# Altium schematic sheet [04] Serial Console.SchDoc: USB-to-Serial converter
size A4; Organization: Blinkinlabs, LLC; DocumentNumber: 4; SheetNumber: 4; SheetTotal: 7
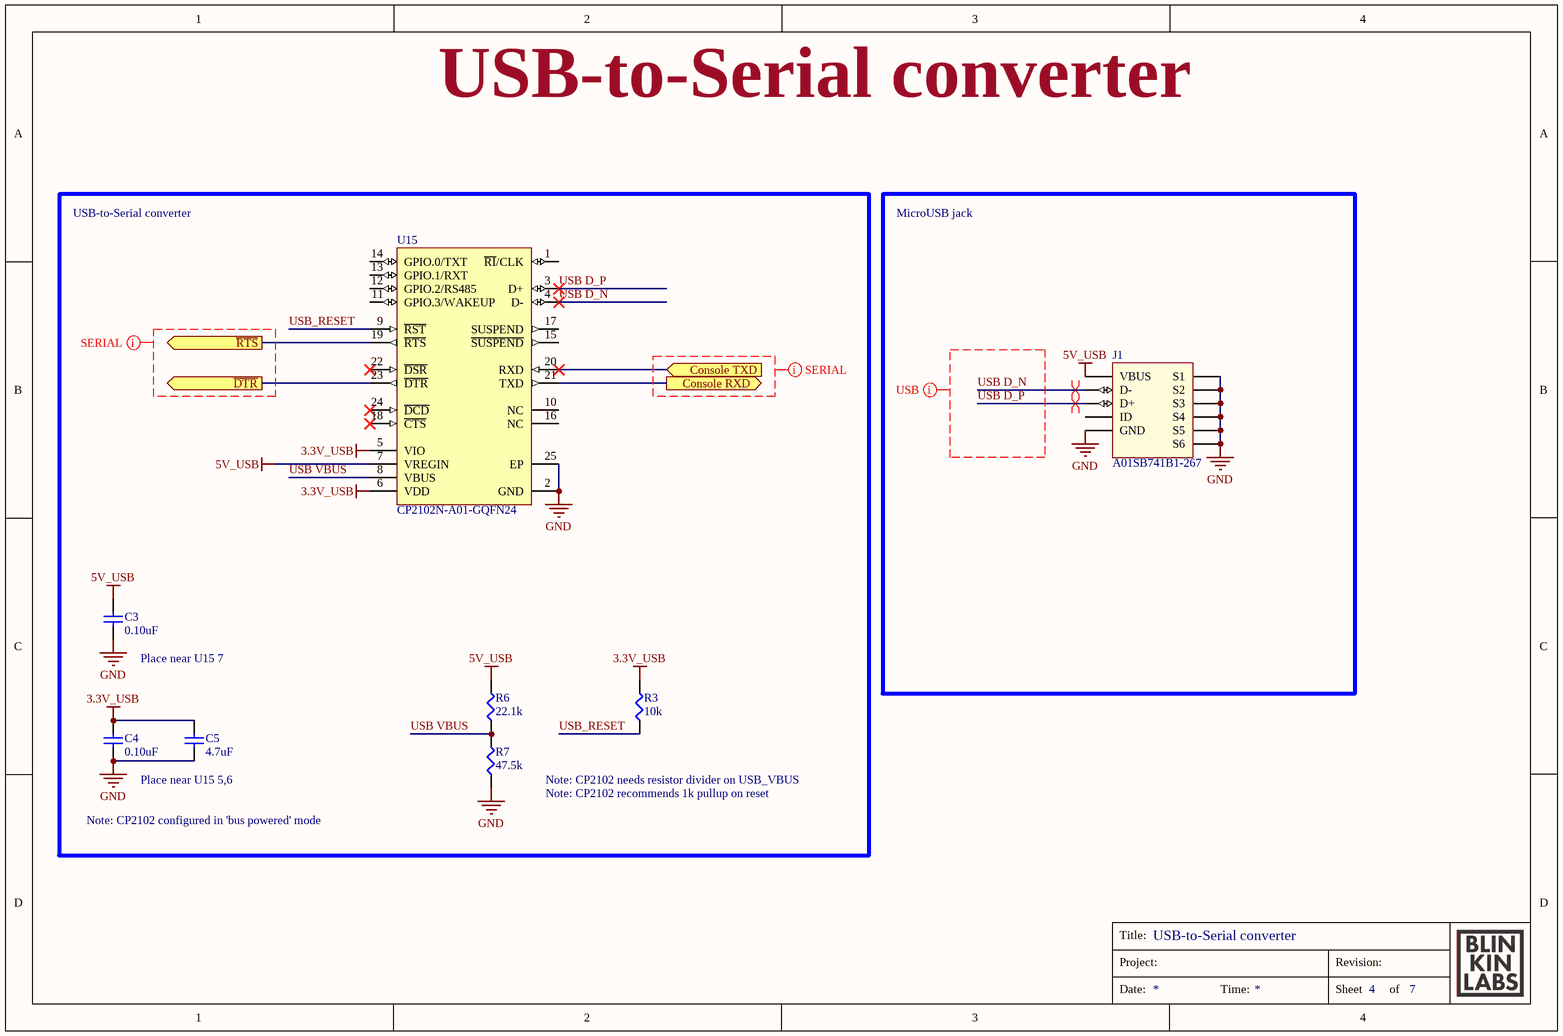
[diagram p0: [04] Serial Console.SchDoc]

## Parts
C3  0.10uF  [CAPC1005X06L]
C4  0.10uF  [CAPC1005X06L]
C5  4.7uF  [CAPC1608X09L]
J1  A01SB741B1-267  [A01SB741B1-267]
R3  10k  [ERJ2G(0402)_L]
R6  22.1k  [ERJ2G(0402)_L]
R7  47.5k  [ERJ2G(0402)_L]
U15  CP2102N-A01-GQFN24  [SLAB-QFN-24-2550x2550TP_A_V]

## Blocks framed on the sheet
MicroUSB jack: J1

## Ports
Console RXD (out), Console TXD (in), ~{DTR} (out), ~{RTS} (out)

## Nets
3.3V_USB: C4.2 C5.1 R3.2 U15.5(VIO) U15.6(VDD)
5V_USB: C3.2 J1.VBUS R6.2 U15.7(VREGIN)
GND: C3.1 C4.1 C5.2 J1.GND J1.S1 J1.S2 J1.S3 J1.S4 J1.S5 J1.S6 R7.1 U15.2(GND) U15.25(EP)
Console RXD: U15.21(TXD) ; port Console RXD
Console TXD: U15.20(RXD) ; port Console TXD
~{DTR}: U15.23(~{DTR}) ; port ~{DTR}
~{RTS}: U15.19(~{RTS}) ; port ~{RTS}
USB D_N: J1.D- U15.4(D-)
USB D_P: J1.D+ U15.3(D+)
USB VBUS: R6.1 R7.2 U15.8(VBUS)
USB_RESET: R3.1 U15.9(~{RST})

Not connected (* = marked no-connect by the designer): J1 ID; U15 1(~{RI}/CLK) 10(NC) 11(GPIO.3/WAKEUP) 12(GPIO.2/RS485) 13(GPIO.1/RXT) 14(GPIO.0/TXT) 15(~{SUSPEND}) 16(NC) 17(SUSPEND) 18(~{CTS})* 22(~{DSR})* 24(~{DCD})*

## Layout directives
net class USB: USB D_N, USB D_P
differential pair: USB D_N, USB D_P
net class SERIAL: (no net found under the mark)

## Notes on the sheet
- USB-to-Serial converter
- (near C3) Place near U15 7
- Place near U15 5,6
- Note: CP2102 needs resistor divider on USB_VBUS
- Note: CP2102 configured in 'bus powered' mode
- Note: CP2102 recommends 1k pullup on reset
- Title:
- Project:
- Revision:
- Date:
- Time:
- Sheet
- of

## Library data of the parts
C3 C4 = GRM152R61A104ME19D: CAP CER 0.1UF 10V X5R 0402; Manufacturer: Murata Electronics North America; Tolerance: ±20%; Datasheets: http://www.murata.com/~/media/webrenewal/support/library/catalog/products/capacitor/mlcc/c02e.pdf; Image: //media.digikey.com/Renders/Murata%20Renders/ZRB-SERIES-0402.jpg; Digi-Key Part Number: 490-10009-1-ND; Packaging: Cut Tape (CT); Series: GRM; Value: 0.10uF; Voltage: 10V; Temperature Coefficient: X5R; Operating Temperature: -55°C ~ 85°C; Features: Derating Recommended; Applications: General Purpose; Package / Case: 0402 (1005 Metric); Case/Package: 0402; PartNumber: GRM152R61A104ME19D
C5 = GRM185R61A475KE11D: CAP CER 4.7UF 10V X5R 0603; Manufacturer: Murata Electronics North America; Tolerance: ±10%; PartNumber: GRM185R61A475KE11D; Datasheets: http://www.murata.com/~/media/webrenewal/support/library/catalog/products/capacitor/mlcc/c02e.pdf; Image: //media.digikey.com/Renders/Murata%20Renders/ZRB-SERIES-0402.jpg; Digi-Key Part Number: 490-11988-1-ND; Series: GRM; Value: 4.7uF; Voltage: 10V; Temperature Coefficient: X5R; Operating Temperature: -55°C ~ 85°C; Features: -; Applications: General Purpose; Package / Case: 0603 (1608 Metric); Case/Package: 0603
J1 = A01SB741B1-267: Micro USB B type 四脚全插牛角; PartNumber: Unknown/Generic; Manufacturer: Unknown/Generic
R3 = ERJ-2GEJ103X: RES SMD 10K OHM 5% 1/10W 0402; Manufacturer: Panasonic Electronic Components; Power (Watts): 0.1W, 1/10W; Temperature Coefficient: ±200ppm/°C; PartNumber: ERJ-2GEJ103X; Datasheets: http://industrial.panasonic.com/www-cgi/jvcr13pz.cgi?E+PZ+3+AOA0001+ERJ2GEJ103X+7+WW; Image: //media.digikey.com/Photos/Panasonic%20Photos/ERJ-PA2-Series.jpg; Digi-Key Part Number: P10KJCT-ND; Series: ERJ; Value: 10k; Tolerance: ±5%; Composition: Thick Film; Features: Automotive AEC-Q200; Operating Temperature: -55°C ~ 155°C; Package / Case: 0402 (1005 Metric); Case/Package: 0402; Size / Dimension: 0.039" L x 0.020" W (1.00mm x 0.50mm); Height - Seated (Max): 0.016" (0.40mm); Number of Terminations: 2
R6 = ERJ-2RKF2212X: RES SMD 22.1K OHM 1% 1/10W 0402; Manufacturer: Panasonic Electronic Components; Power (Watts): 0.1W, 1/10W; Temperature Coefficient: ±100ppm/°C; PartNumber: ERJ-2RKF2212X; Datasheets: http://industrial.panasonic.com/www-cgi/jvcr13pz.cgi?E+PZ+3+AOA0002+ERJ2RKF2212X+7+WW; Image: //media.digikey.com/Photos/Panasonic%20Photos/ERJ-PA2-Series.jpg; Digi-Key Part Number: P22.1KLCT-ND; Series: ERJ; Value: 22.1k; Tolerance: ±1%; Composition: Thick Film; Features: Automotive AEC-Q200; Operating Temperature: -55°C ~ 155°C; Package / Case: 0402 (1005 Metric); Case/Package: 0402; Size / Dimension: 0.039" L x 0.020" W (1.00mm x 0.50mm); Height - Seated (Max): 0.016" (0.40mm); Number of Terminations: 2
R7 = ERJ-2RKF4752X: RES SMD 47.5K OHM 1% 1/10W 0402; Manufacturer: Panasonic Electronic Components; Power (Watts): 0.1W, 1/10W; Temperature Coefficient: ±100ppm/°C; PartNumber: ERJ-2RKF4752X; Datasheets: http://industrial.panasonic.com/www-cgi/jvcr13pz.cgi?E+PZ+3+AOA0002+ERJ2RKF4752X+7+WW; Image: //media.digikey.com/Photos/Panasonic%20Photos/ERJ-PA2-Series.jpg; Digi-Key Part Number: P47.5KLCT-ND; Series: ERJ; Value: 47.5k; Tolerance: ±1%; Composition: Thick Film; Features: Automotive AEC-Q200; Operating Temperature: -55°C ~ 155°C; Package / Case: 0402 (1005 Metric); Case/Package: 0402; Size / Dimension: 0.039" L x 0.020" W (1.00mm x 0.50mm); Height - Seated (Max): 0.016" (0.40mm); Number of Terminations: 2
U15 = CMP-2000-07570-1: USBXpress(TM) Family, 4 GPIOs, 2.2 to 3.6 V, -40 to 85 degC, 24-Pin QFN, RoHS; Manufacturer: Silicon Labs; Max Supply Voltage: 3.6V; Min Supply Voltage: 3V; Datasheet Version: Rev. 1.1, 08/2016; Max Operating Temperature: 85degC; Case\/Package: QFN; Number of Pins: 24; Min Operating Temperature: -40degC; Mounting Technology: SurfaceMount; Manufacturer URL: http://www.silabs.com/; RoHSCompliant: False; Package Reference: QFN-24-2550x2550TP_A; Datasheet URL: http://www.silabs.com/documents/public/data-sheets/cp2102n-datasheet.pdf; Package Description: 24-Pin Quad Flat No-lead Package, Body 4 x 4 mm, Pitch 0.5 mm; REACH SVHC: Unknown